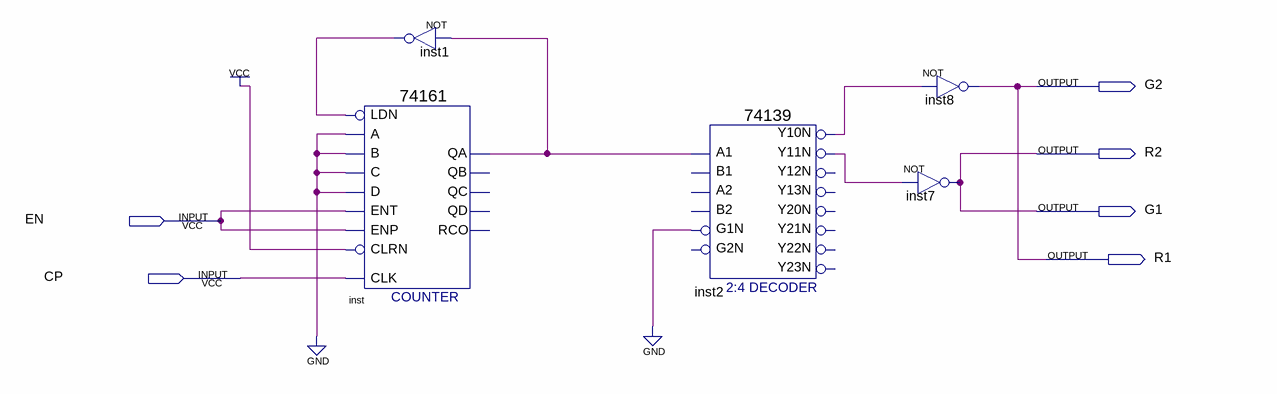
[diagram p0: schematic sheet]
// Quartus schematic control.bdf as structural Verilog: 5 symbols, 6 pins
module control (
  input  EN,
  input  CP,
  output G2,
  output R2,
  output G1,
  output R1
);

  wire inst1_out, inst2_y10n, inst2_y11n, inst_qa;

  not inst1 (inst1_out, inst_qa);
  \74161  inst (
    .CLRN(1'b1), .CLK(CP), .ENP(EN), .LDN(inst1_out), .A(1'b0), .D(1'b0), .ENT(EN), .B(1'b0), .C(1'b0),
    .QA(inst_qa));  // open: QD, QC, QB, RCO
  \74139  inst2 (
    .A1(inst_qa), .G1N(1'b0), .Y10N(inst2_y10n), .Y11N(inst2_y11n));  // open: A2, B1, B2, G2N, Y20N, Y13N, Y12N, Y21N, Y22N, Y23N
  not inst8 (G2, inst2_y10n);
  not inst7 (G1, inst2_y11n);

  assign R1 = G2;
  assign R2 = G1;
endmodule
